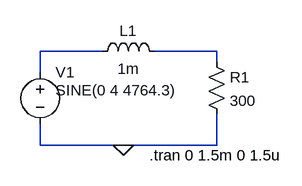
[diagram p0: schematic Exp3Part1c.asc]
Exp3Part1c.asc, the LTspice schematic file:
Version 4
SHEET 1 880 680
WIRE 128 96 32 96
WIRE 304 96 208 96
WIRE 304 112 304 96
WIRE 32 128 32 96
WIRE 32 240 32 208
WIRE 160 240 32 240
WIRE 304 240 304 192
WIRE 304 240 160 240
FLAG 160 240 0
SYMBOL res 288 96 R0
SYMATTR InstName R1
SYMATTR Value 300
SYMBOL ind 112 112 R270
WINDOW 0 32 56 VTop 2
WINDOW 3 5 56 VBottom 2
SYMATTR InstName L1
SYMATTR Value 1m
SYMBOL voltage 32 112 R0
WINDOW 123 -98 52 Left 2
WINDOW 39 0 0 Left 0
WINDOW 3 24 44 Left 2
SYMATTR InstName V1
SYMATTR Value SINE(0 4 4764.3)
TEXT 200 256 Left 2 !.tran 0 1.5m 0 1.5u

The netlist it stands for:
* Exp3Part1c.asc
R1 N002 0 300
L1 N001 N002 1m
V1 N001 0 SINE(0 4 4764.3)
.tran 0 1.5m 0 1.5u
.backanno
.end